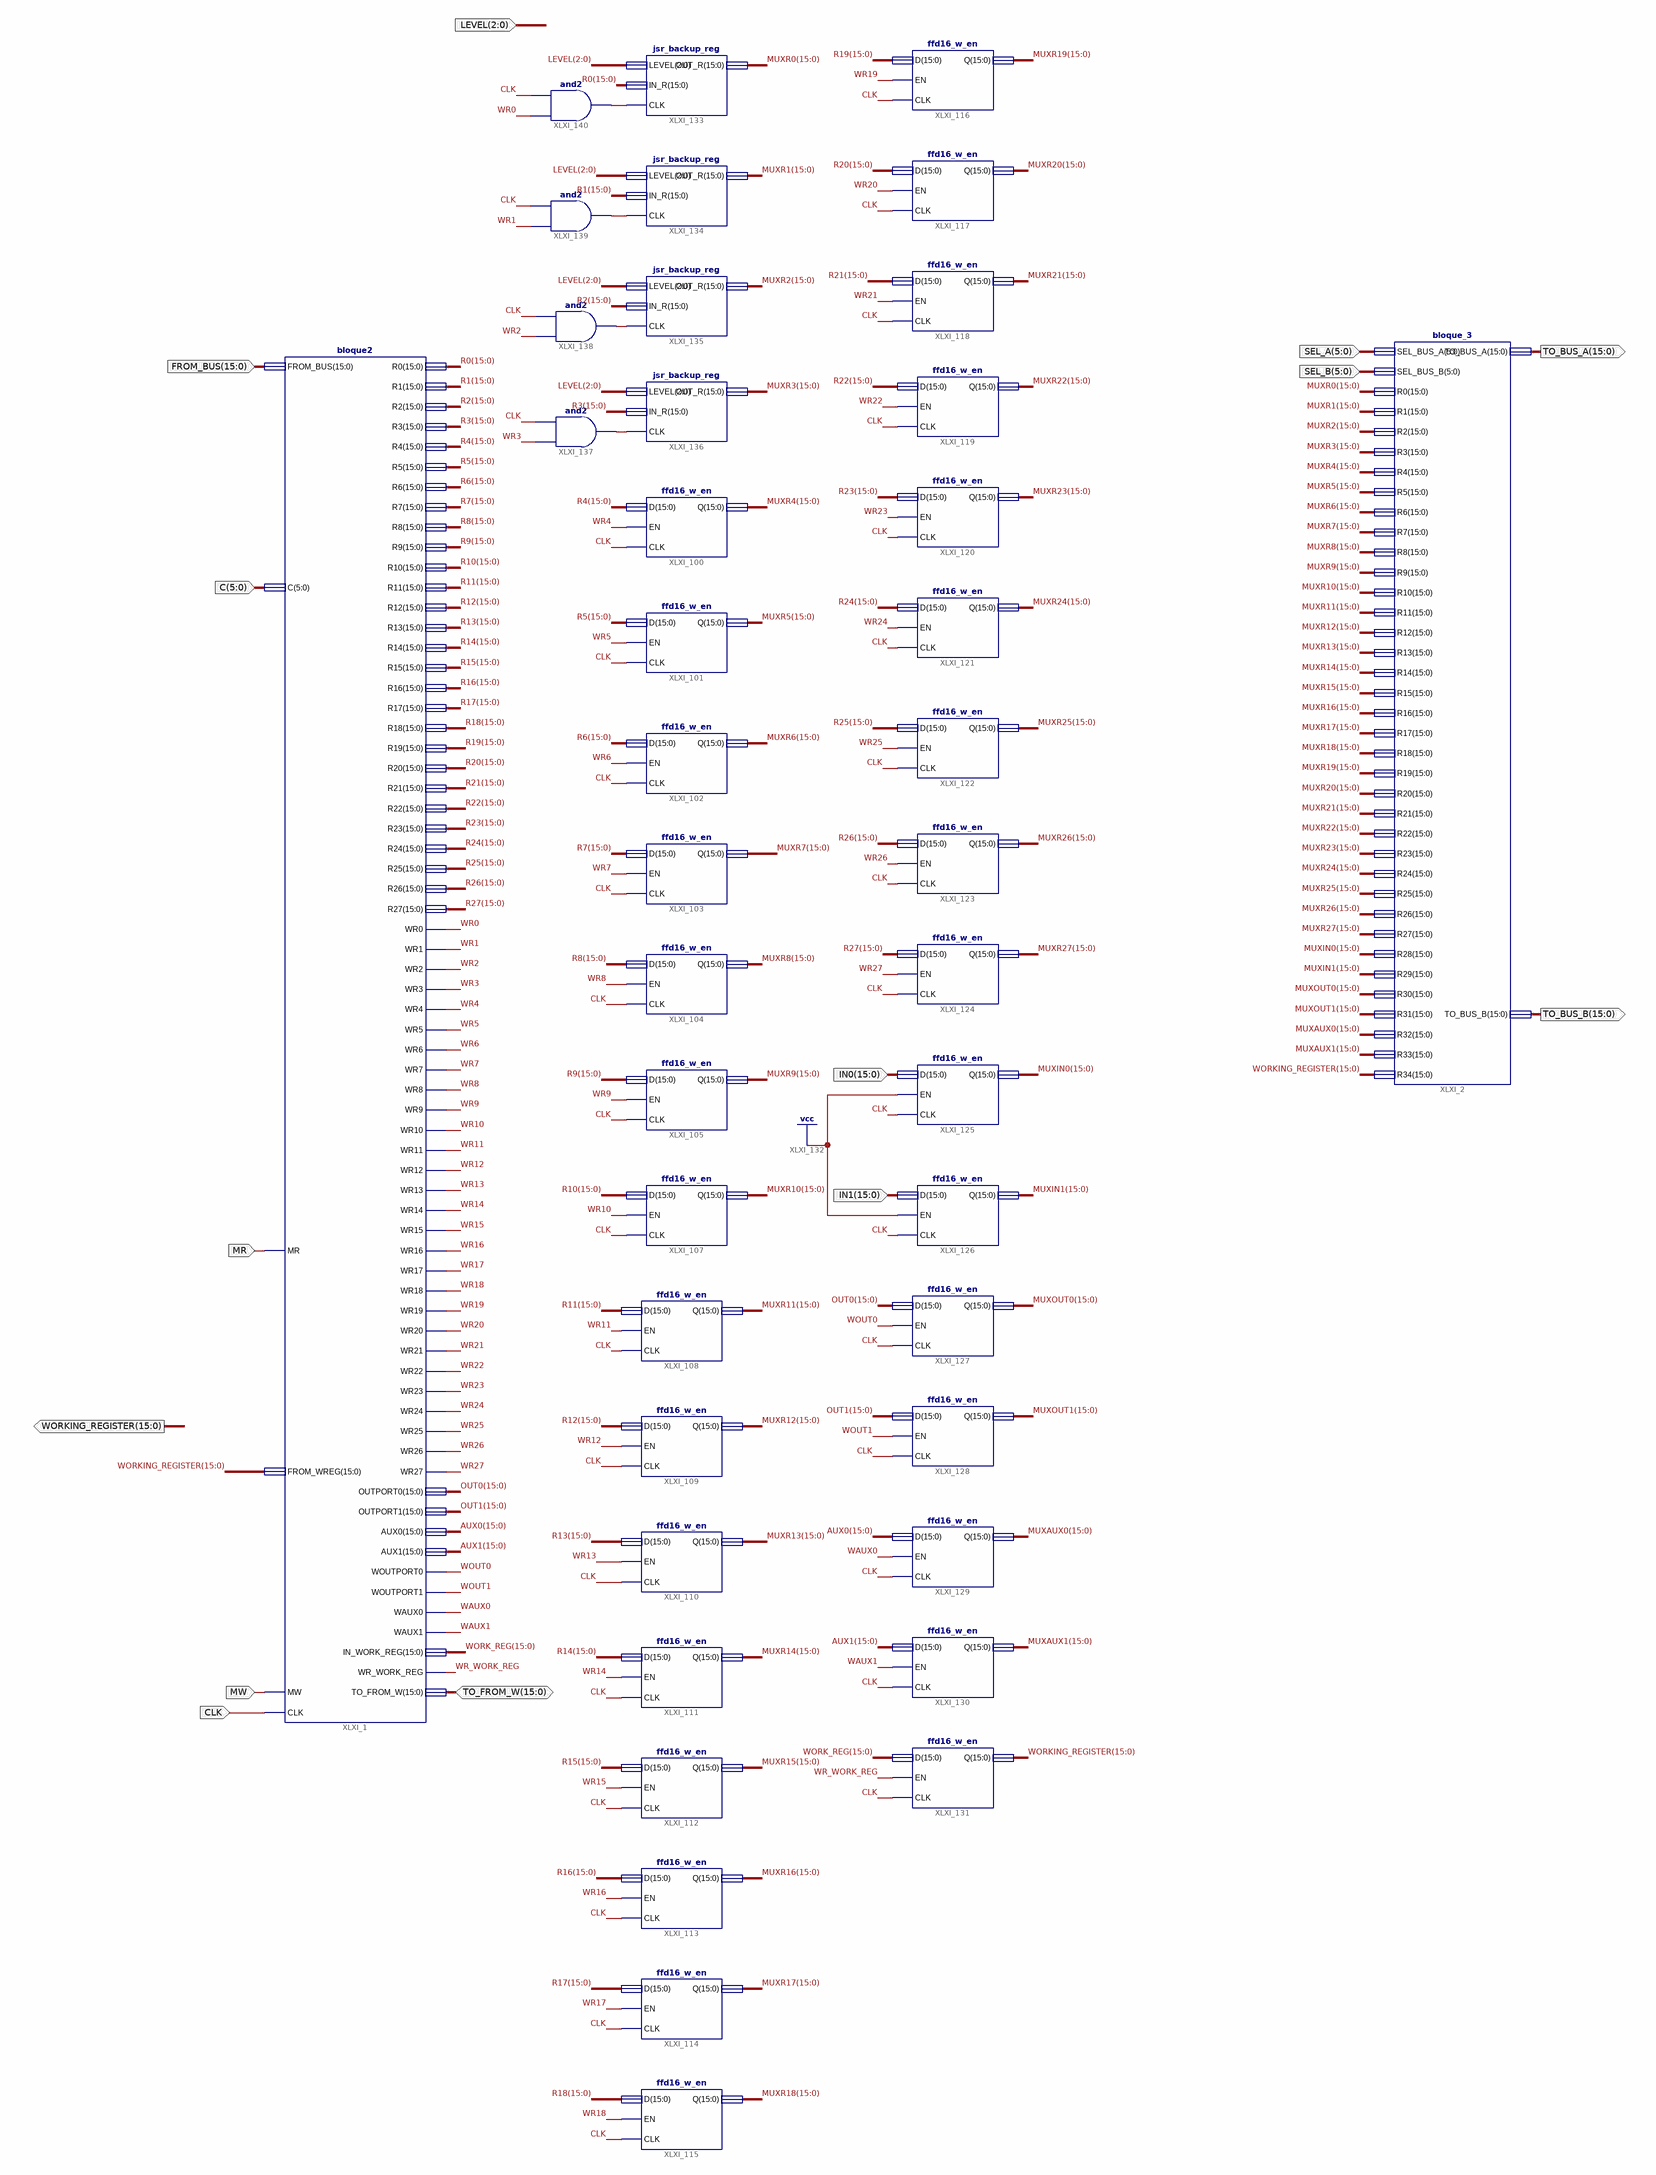
[diagram p0: schematic sheet 1]
// Xilinx ISE schematic register_bank.sch (artix7) as structural Verilog: 41 symbols, 14 ports
module register_bank (
  input  [5:0] SEL_A,
  input  [5:0] SEL_B,
  input  CLK,
  input  [15:0] IN0,
  input  [15:0] IN1,
  input  [15:0] FROM_BUS,
  input  [5:0] C,
  input  MR,
  input  MW,
  input  [2:0] LEVEL,
  inout  [15:0] TO_FROM_W,
  output [15:0] TO_BUS_A,
  output [15:0] TO_BUS_B,
  output [15:0] WORKING_REGISTER
);

  wire WAUX0, WAUX1, WOUT0, WOUT1, WR0, WR1, WR2, WR3, WR4, WR5, WR6, WR7, WR8, WR9, WR10, WR11, WR12, WR13,
       WR14, WR15, WR16, WR17, WR18, WR19, WR20, WR21, WR22, WR23, WR24, WR25, WR26, WR27, WR_WORK_REG,
       XLXN_37, XLXN_40, XLXN_41, XLXN_42;
  wire [15:0] AUX0, AUX1, MUXAUX0, MUXAUX1, MUXIN0, MUXIN1, MUXOUT0, MUXOUT1, MUXR0, MUXR1, MUXR2, MUXR3,
       MUXR4, MUXR5, MUXR6, MUXR7, MUXR8, MUXR9, MUXR10, MUXR11, MUXR12, MUXR13, MUXR14, MUXR15, MUXR16,
       MUXR17, MUXR18, MUXR19, MUXR20, MUXR21, MUXR22, MUXR23, MUXR24, MUXR25, MUXR26, MUXR27, OUT0, OUT1,
       R0, R1, R2, R3, R4, R5, R6, R7, R8, R9, R10, R11, R12, R13, R14, R15, R16, R17, R18, R19, R20, R21,
       R22, R23, R24, R25, R26, R27, WORK_REG;

  bloque_3 XLXI_2 (
    .SEL_BUS_A(SEL_A), .SEL_BUS_B(SEL_B), .R0(MUXR0), .R1(MUXR1), .R2(MUXR2), .R3(MUXR3), .R4(MUXR4),
    .R5(MUXR5), .R6(MUXR6), .R7(MUXR7), .R8(MUXR8), .R9(MUXR9), .R10(MUXR10), .R11(MUXR11), .R12(MUXR12),
    .R13(MUXR13), .R14(MUXR14), .R15(MUXR15), .R16(MUXR16), .R17(MUXR17), .R18(MUXR18), .R19(MUXR19),
    .R20(MUXR20), .R21(MUXR21), .R22(MUXR22), .R23(MUXR23), .R24(MUXR24), .R25(MUXR25), .R26(MUXR26),
    .R27(MUXR27), .R28(MUXIN0), .R29(MUXIN1), .R30(MUXOUT0), .R31(MUXOUT1), .TO_BUS_A(TO_BUS_A),
    .TO_BUS_B(TO_BUS_B), .R32(MUXAUX0), .R33(MUXAUX1), .R34(WORKING_REGISTER));
  bloque2 XLXI_1 (
    .FROM_BUS(FROM_BUS), .C(C), .MR(MR), .FROM_WREG(WORKING_REGISTER), .CLK(CLK), .MW(MW),
    .TO_FROM_W(TO_FROM_W), .R1(R1), .R2(R2), .R3(R3), .R4(R4), .R5(R5), .R6(R6), .R7(R7), .R8(R8), .R9(R9),
    .R10(R10), .R11(R11), .R12(R12), .R13(R13), .R14(R14), .R15(R15), .R16(R16), .R17(R17), .R18(R18),
    .R19(R19), .R20(R20), .R21(R21), .R22(R22), .R23(R23), .R24(R24), .R25(R25), .R26(R26), .R27(R27),
    .WR0(WR0), .WR1(WR1), .WR2(WR2), .WR3(WR3), .WR4(WR4), .WR5(WR5), .WR6(WR6), .WR7(WR7), .WR8(WR8),
    .WR9(WR9), .WR10(WR10), .WR11(WR11), .WR12(WR12), .WR13(WR13), .WR14(WR14), .WR15(WR15), .WR16(WR16),
    .WR17(WR17), .WR18(WR18), .WR19(WR19), .WR20(WR20), .WR21(WR21), .WR22(WR22), .WR23(WR23), .WR24(WR24),
    .WR25(WR25), .WR26(WR26), .WR27(WR27), .OUTPORT0(OUT0), .OUTPORT1(OUT1), .AUX0(AUX0), .AUX1(AUX1),
    .WOUTPORT0(WOUT0), .WOUTPORT1(WOUT1), .WAUX0(WAUX0), .WAUX1(WAUX1), .IN_WORK_REG(WORK_REG),
    .WR_WORK_REG(WR_WORK_REG), .R0(R0));
  ffd16_w_en XLXI_100 (.D(R4), .EN(WR4), .CLK(CLK), .Q(MUXR4));
  ffd16_w_en XLXI_101 (.D(R5), .EN(WR5), .CLK(CLK), .Q(MUXR5));
  ffd16_w_en XLXI_102 (.D(R6), .EN(WR6), .CLK(CLK), .Q(MUXR6));
  ffd16_w_en XLXI_103 (.D(R7), .EN(WR7), .CLK(CLK), .Q(MUXR7));
  ffd16_w_en XLXI_104 (.D(R8), .EN(WR8), .CLK(CLK), .Q(MUXR8));
  ffd16_w_en XLXI_105 (.D(R9), .EN(WR9), .CLK(CLK), .Q(MUXR9));
  ffd16_w_en XLXI_107 (.D(R10), .EN(WR10), .CLK(CLK), .Q(MUXR10));
  ffd16_w_en XLXI_108 (.D(R11), .EN(WR11), .CLK(CLK), .Q(MUXR11));
  ffd16_w_en XLXI_109 (.D(R12), .EN(WR12), .CLK(CLK), .Q(MUXR12));
  ffd16_w_en XLXI_110 (.D(R13), .EN(WR13), .CLK(CLK), .Q(MUXR13));
  ffd16_w_en XLXI_111 (.D(R14), .EN(WR14), .CLK(CLK), .Q(MUXR14));
  ffd16_w_en XLXI_112 (.D(R15), .EN(WR15), .CLK(CLK), .Q(MUXR15));
  ffd16_w_en XLXI_113 (.D(R16), .EN(WR16), .CLK(CLK), .Q(MUXR16));
  ffd16_w_en XLXI_114 (.D(R17), .EN(WR17), .CLK(CLK), .Q(MUXR17));
  ffd16_w_en XLXI_115 (.D(R18), .EN(WR18), .CLK(CLK), .Q(MUXR18));
  ffd16_w_en XLXI_116 (.D(R19), .EN(WR19), .CLK(CLK), .Q(MUXR19));
  ffd16_w_en XLXI_117 (.D(R20), .EN(WR20), .CLK(CLK), .Q(MUXR20));
  ffd16_w_en XLXI_118 (.D(R21), .EN(WR21), .CLK(CLK), .Q(MUXR21));
  ffd16_w_en XLXI_119 (.D(R22), .EN(WR22), .CLK(CLK), .Q(MUXR22));
  ffd16_w_en XLXI_120 (.D(R23), .EN(WR23), .CLK(CLK), .Q(MUXR23));
  ffd16_w_en XLXI_121 (.D(R24), .EN(WR24), .CLK(CLK), .Q(MUXR24));
  ffd16_w_en XLXI_122 (.D(R25), .EN(WR25), .CLK(CLK), .Q(MUXR25));
  ffd16_w_en XLXI_123 (.D(R26), .EN(WR26), .CLK(CLK), .Q(MUXR26));
  ffd16_w_en XLXI_124 (.D(R27), .EN(WR27), .CLK(CLK), .Q(MUXR27));
  ffd16_w_en XLXI_125 (.D(IN0), .EN(1'b1), .CLK(CLK), .Q(MUXIN0));
  ffd16_w_en XLXI_126 (.D(IN1), .EN(1'b1), .CLK(CLK), .Q(MUXIN1));
  ffd16_w_en XLXI_127 (.D(OUT0), .EN(WOUT0), .CLK(CLK), .Q(MUXOUT0));
  ffd16_w_en XLXI_128 (.D(OUT1), .EN(WOUT1), .CLK(CLK), .Q(MUXOUT1));
  ffd16_w_en XLXI_129 (.D(AUX0), .EN(WAUX0), .CLK(CLK), .Q(MUXAUX0));
  ffd16_w_en XLXI_130 (.D(AUX1), .EN(WAUX1), .CLK(CLK), .Q(MUXAUX1));
  ffd16_w_en XLXI_131 (.D(WORK_REG), .EN(WR_WORK_REG), .CLK(CLK), .Q(WORKING_REGISTER));
  jsr_backup_reg XLXI_133 (.LEVEL(LEVEL), .IN_R(R0), .CLK(XLXN_42), .OUT_R(MUXR0));
  jsr_backup_reg XLXI_134 (.LEVEL(LEVEL), .IN_R(R1), .CLK(XLXN_41), .OUT_R(MUXR1));
  jsr_backup_reg XLXI_136 (.LEVEL(LEVEL), .IN_R(R3), .CLK(XLXN_37), .OUT_R(MUXR3));
  and XLXI_137 (XLXN_37, WR3, CLK);
  and XLXI_138 (XLXN_40, WR2, CLK);
  and XLXI_139 (XLXN_41, WR1, CLK);
  and XLXI_140 (XLXN_42, WR0, CLK);
  jsr_backup_reg XLXI_135 (.LEVEL(LEVEL), .IN_R(R2), .CLK(XLXN_40), .OUT_R(MUXR2));
endmodule
